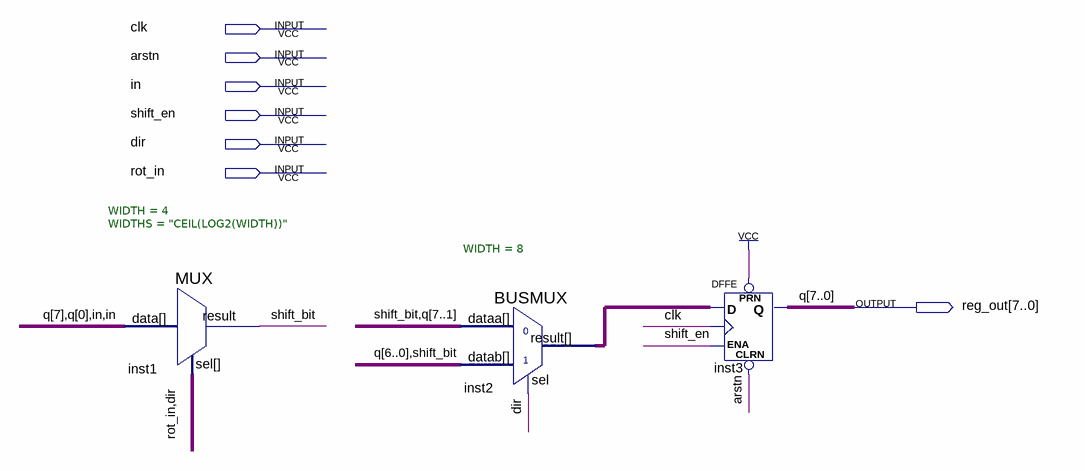
[diagram p0: schematic sheet]
// Quartus schematic ShiftRegister.bdf as structural Verilog: 3 symbols, 7 pins
module ShiftRegister (
  input  clk,
  input  arstn,
  input  in,
  input  shift_en,
  input  dir,
  input  rot_in,
  output [7:0] reg_out
);

  wire shift_bit;
  wire [7:0] inst2_result;

  MUX #(.WIDTH(4), .WIDTHS("CEIL(LOG2(WIDTH))")) inst1 (
    .data({reg_out[7], reg_out[0], {2{in}}}), .sel({rot_in, dir}), .result(shift_bit));
  BUSMUX #(.WIDTH(8)) inst2 (
    .datab({reg_out[6:0], shift_bit}), .sel(dir), .dataa({shift_bit, reg_out[7:1]}), .result(inst2_result));
  DFFE inst3[7:0] (.PRN(1'b1), .CLRN(arstn), .D(inst2_result), .CLK(clk), .ENA(shift_en), .Q(reg_out));

  // Other names for the same wires on the sheet: q[7:0] = reg_out
endmodule
